# Altium schematic sheet Pico_pinout.SchDoc
size D; SheetNumber: 1; SheetTotal: 1
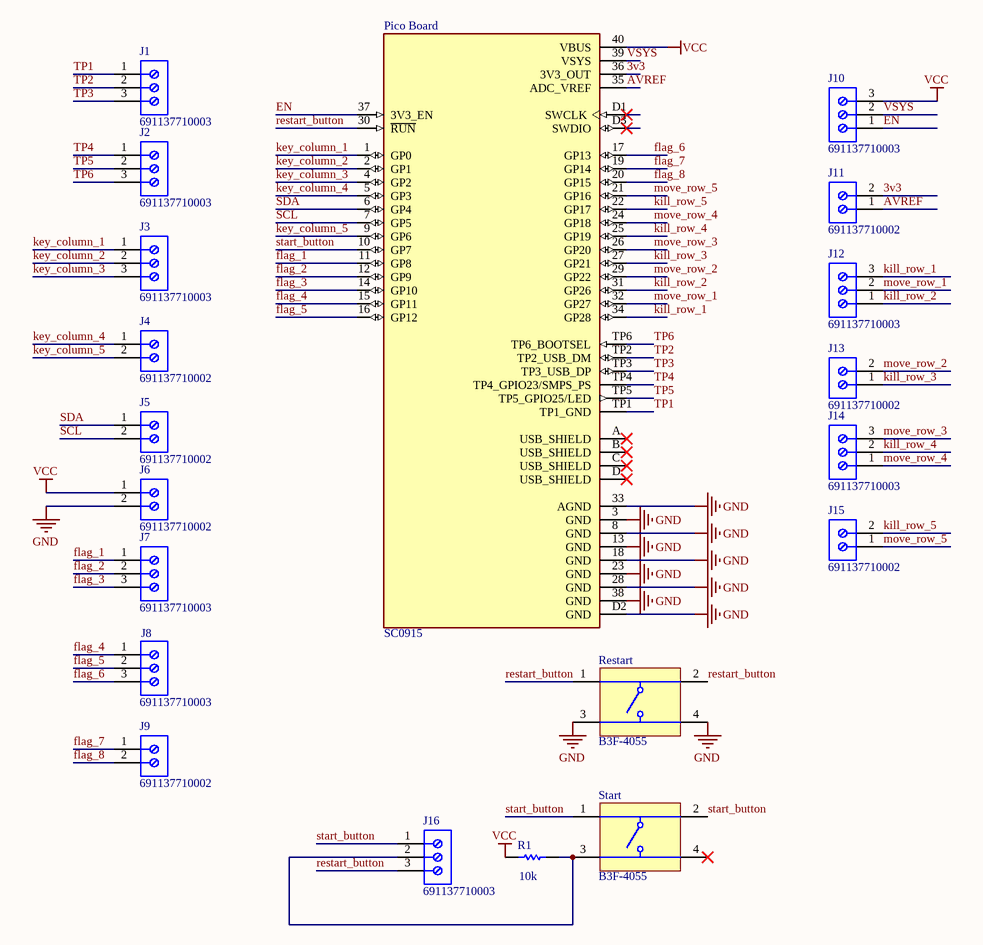
[diagram p0: Pico_pinout.SchDoc]

## Parts
J1  691137710003  [691137710003]
J2  691137710003  [691137710003]
J3  691137710003  [691137710003]
J4  691137710002  [691137710002]
J5  691137710002  [691137710002]
J6  691137710002  [691137710002]
J7  691137710003  [691137710003]
J8  691137710003  [691137710003]
J9  691137710002  [691137710002]
J10  691137710003  [691137710003]
J11  691137710002  [691137710002]
J12  691137710003  [691137710003]
J13  691137710002  [691137710002]
J14  691137710003  [691137710003]
J15  691137710002  [691137710002]
J16  691137710003  [691137710003]
Pico_Board  SC0915  [MODULE_SC0915]
R1  10k  [RESC3116X65X40ML10T20]
Restart  B3F-4055  [OMRON-B3F-4055_V]
Start  B3F-4055  [OMRON-B3F-4055_V]

## Nets
GND: J6.2 Pico_Board.3(GND) Pico_Board.8(GND) Pico_Board.13(GND) Pico_Board.18(GND) Pico_Board.23(GND) Pico_Board.28(GND) Pico_Board.33(AGND) Pico_Board.38(GND) Pico_Board.D2(GND) Restart.3 Restart.4
VCC: J6.1 J10.3 Pico_Board.40(VBUS) R1.1
3v3: J11.2 Pico_Board.36(3V3_OUT)
AVREF: J11.1 Pico_Board.35(ADC_VREF)
EN: J10.1 Pico_Board.37(3V3_EN)
flag_1: J7.1 Pico_Board.11(GP8)
flag_2: J7.2 Pico_Board.12(GP9)
flag_3: J7.3 Pico_Board.14(GP10)
flag_4: J8.1 Pico_Board.15(GP11)
flag_5: J8.2 Pico_Board.16(GP12)
flag_6: J8.3 Pico_Board.17(GP13)
flag_7: J9.1 Pico_Board.19(GP14)
flag_8: J9.2 Pico_Board.20(GP15)
key_column_1: J3.1 Pico_Board.1(GP0)
key_column_2: J3.2 Pico_Board.2(GP1)
key_column_3: J3.3 Pico_Board.4(GP2)
key_column_4: J4.1 Pico_Board.5(GP3)
key_column_5: J4.2 Pico_Board.9(GP6)
kill_row_1: J12.3 Pico_Board.34(GP28)
kill_row_2: J12.1 Pico_Board.31(GP26)
kill_row_3: J13.1 Pico_Board.27(GP21)
kill_row_4: J14.2 Pico_Board.25(GP19)
kill_row_5: J15.2 Pico_Board.22(GP17)
move_row_1: J12.2 Pico_Board.32(GP27)
move_row_2: J13.2 Pico_Board.29(GP22)
move_row_3: J14.3 Pico_Board.26(GP20)
move_row_4: J14.1 Pico_Board.24(GP18)
move_row_5: J15.1 Pico_Board.21(GP16)
restart_button: J16.3 Pico_Board.30(~{RUN}) Restart.1 Restart.2
SCL: J5.2 Pico_Board.7(GP5)
SDA: J5.1 Pico_Board.6(GP4)
start_button: J16.1 Pico_Board.10(GP7) Start.1 Start.2
TP1: J1.1 Pico_Board.TP1(TP1_GND)
TP2: J1.2 Pico_Board.TP2(TP2_USB_DM)
TP3: J1.3 Pico_Board.TP3(TP3_USB_DP)
TP4: J2.1 Pico_Board.TP4(TP4_GPIO23/SMPS_PS)
TP5: J2.2 Pico_Board.TP5(TP5_GPIO25/LED)
TP6: J2.3 Pico_Board.TP6(TP6_BOOTSEL)
VSYS: J10.2 Pico_Board.39(VSYS)
NetJ16_2: J16.2 R1.2 Start.3

Not connected (* = marked no-connect by the designer): Pico_Board A(USB_SHIELD)* B(USB_SHIELD)* C(USB_SHIELD)* D(USB_SHIELD)* D1(SWCLK)* D3(SWDIO)*; Start 4*

## Library data of the parts
J1-J3 J7 J8 J10 J12 J14 J16 = CMP-1502-03325-2: NexarPartId: 78871138; Number of Pins: 3; Packaging: Box; RoHS: Non-Compliant; Lead Pitch: 5mm
J4-J6 J9 J11 J13 J15 = CMP-1502-03324-2: NexarPartId: 78871135; Voltage Rating: 300V; Number of Contacts: 2; Current Rating: 16A; Lead Pitch: 5mm; Height: 11.6mm; Packaging: Box; RoHS: Non-Compliant; Contact Material: Nickel, Tin; Max Operating Temperature: 120°C; Number of Pins: 2; Min Operating Temperature: -30°C; Number of Rows: 1
Pico_Board = SC0915: RP2040 Raspberry Pi Pico series ARMÂ® CortexÂ®-M0+ MCU 32-Bit Embedded Evaluation Board; SnapEDA_Link: https://www.snapeda.com/parts/SC0915/Raspberry+Pi/view-part/?ref=snap; Availability: In Stock; Package: None; Price: None; MP: SC0915; Check_prices: https://www.snapeda.com/parts/SC0915/Raspberry+Pi/view-part/?ref=eda; MF: Raspberry Pi; Value: *; Purchase-URL: https://pricing.snapeda.com/search/part/SC0915/?ref=eda
R1 = CMP-1014-00623-2: Chip Resistor, 10 KOhm, +/- 1%, 0.25 W, -55 to 155 degC, 1206 (3216 Metric), RoHS, Tape and Reel; Manufacturer: Yageo; Voltage Rating: 200V; Resistance: 10KOhm; Temperature Coefficient: 100ppm/degreesC; Power Rating: 250mW; Packaging: TapeandReel; Termination: SMD/SMT; REACH SVHC: Unknown; Tolerance: 1%; Height: 0.55mm; Composition: ThickFilm; Max Operating Temperature: 155degC; Datasheet Version: Rev. 5, 10/2016; Lead Free: LeadFree; Case Code (Metric): 3216; Depth: 1.6mm; Package Quantity: 5000; RoHSCompliant: true; Military Standard: Not; Case/Package: 1206; Case Code (Imperial): 1206; Min Operating Temperature: -55degC; Datasheet URL: http://www.yageo.com/NewPortal/yageodocoutput?fileName=/pdf/R-Chip/PYu-RC_Group_51_RoHS_L_5.pdf; Length: 3.1mm; Manufacturer URL: http://www.yageo.com/; Package Reference: 1206.0; Width: 1.6mm; Package Description: 2-Pin Surface Mount Device, Body 3.1 x 1.6 mm
Restart Start = CMP-2000-05902-1: Tactile Switch, 1 to 50 mA, 100 mOhm Max, 5 to 24 VDC, -25 to 70 degC, 4-Pin THD, RoHS, Bulk; Manufacturer: OmronElectronics; Contact Rating @ Voltage: 0.05@24VDCA; Pole Throw Configuration: SPST; Dielectric Strength: 500VAC; Maximum DC Voltage Rating: 24V; Electrical Life: 1000000Cycles; Product Weight: 0.85g; Switch Configuration: N.O.; Actuator Style: ProjectedPlunger; Actuator Color: Orange; Actuator Length: 3mm; Illumination Type: N/R; Body Orientation: Straight; Operating Force: 2.55N; Ground Terminal: No; Datasheet URL: https://datasheet.ciiva.com/20148/78-0136-20148640.pdf; Seal Location: N/A; Mechanical Life: N/A; Operating Temperature: -25to70C; Maximum AC Voltage Rating: N/A; Dimension: 12x12x7.3mm; Minimum Insulation Resistance: 100MOhm; Mounting: ThroughHole,PCPins; Housing Material: N/A; Packaging: Bag; Part No: B3F-4055; Maximum Contact Resistance: 100mOhm; Base Material: N/A; Manufacturer URL: http://www.omron.com/; RoHS: Yes; Contact Material: N/A; Package Description: 4-Pin Through Hole Device, Body 12 x 12 mm; Family: B3F; Mounting Technology: ThroughHole; Package Reference: B3F-4055; Contact Plating: Gold; Seal Description: N/A; Type: Miniature; Datasheet Version: 06/2009